# EAGLE schematic MotorController (EAGLE 9.6.1)
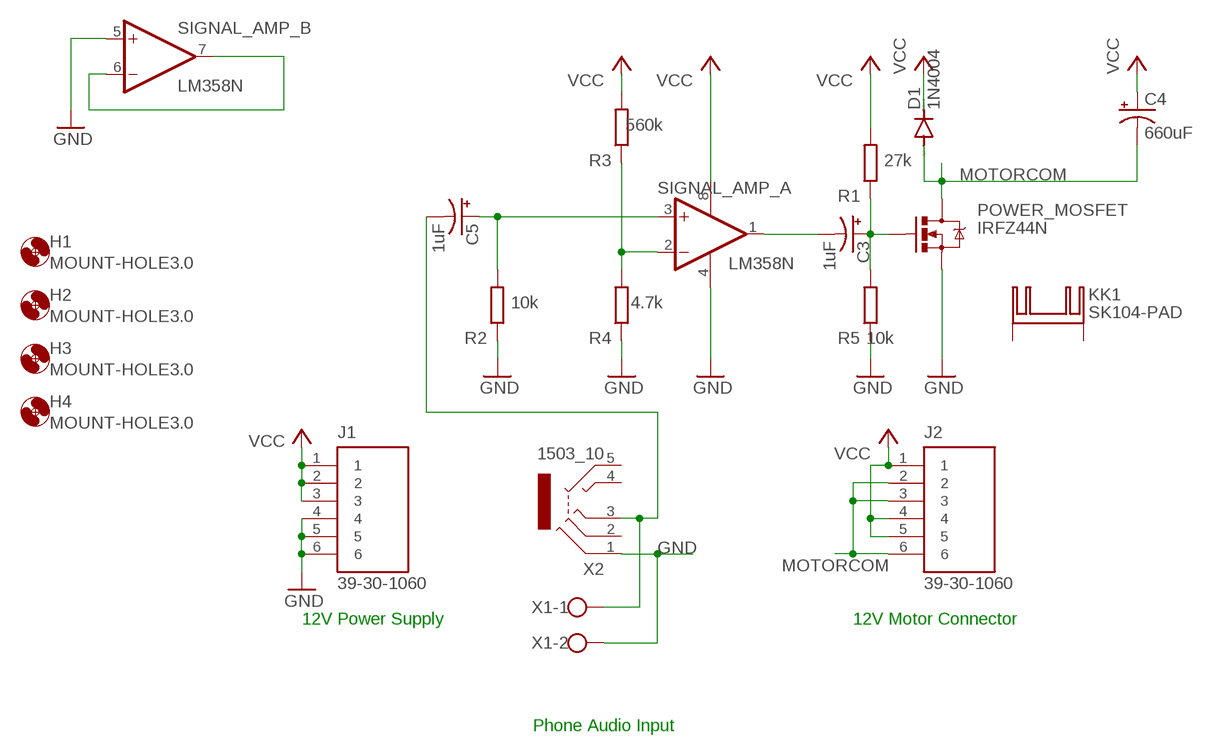
[diagram p0: schematic, sheet 1]

## Parts
C3  1uF  CPOL-USE2.5-7  [E2,5-7]
C4  660uF  CPOL-USE5-10.5  [E5-10,5]
C5  1uF  CPOL-USE2.5-7  [E2,5-7]
D1  1N4004  [DO41-10]
H1  MOUNT-HOLE3.0  [3,0]
H2  MOUNT-HOLE3.0  [3,0]
H3  MOUNT-HOLE3.0  [3,0]
H4  MOUNT-HOLE3.0  [3,0]
J1  39-30-1060  [MOLEX_39-30-1060]
J2  39-30-1060  [MOLEX_39-30-1060]
KK1  SK104-PAD  [SK104-PAD]
POWER_MOSFET  IRFZ44N  [TO-220]
R1  27k  R-EU_0204/7  [0204/7]
R2  10k  R-EU_0204/7  [0204/7]
R3  560k  R-EU_0204/7  [0204/7]
R4  4.7k  R-EU_0204/7  [0204/7]
R5  10k  R-EU_0204/7  [0204/7]
SIGNAL_AMP_  LM358N  [DIL08]
X1  W237-102  [W237-102]
X2  1503_10  [1503_10]

## Nets
GND [Power]: J1.4 J1.5 J1.6 POWER_MOSFET.3(S) R2.1 R4.1 R5.1 SIGNAL_AMP_.4(P:V-) SIGNAL_AMP_.5(B:+IN) X1.2 X2.1
MOTORCOM [Power]: C4.- D1.A J2.2 J2.3 J2.6 POWER_MOSFET.2(D)
N$1 [Signal]: C5.+ R2.2 SIGNAL_AMP_.3(A:+IN)
N$2 [Signal]: R3.1 R4.2 SIGNAL_AMP_.2(A:-IN)
N$3 [Signal]: C3.- SIGNAL_AMP_.1(A:OUT)
N$4 [Signal]: C3.+ POWER_MOSFET.1(G) R1.1 R5.2
N$5: SIGNAL_AMP_.6(B:-IN) SIGNAL_AMP_.7(B:OUT)
N$7 [Signal]: C5.- X1.1 X2.3
VCC [Power]: C4.+ D1.C J1.1 J1.2 J1.3 J2.1 J2.4 J2.5 R1.2 R3.2 SIGNAL_AMP_.8(P:V+)
Unconnected: KK1.K1(K) KK1.K2(K) X2.2 X2.4 X2.5

## Notes on the sheet
- 12V Power Supply | 12V Motor Connector
- Phone Audio Input

## Library data of the parts
C3-C5 = adafruit:CPOL-US: POLARIZED CAPACITOR, American symbol
D1 = diode:1N4004: DIODE general purpose rectifier, 1 A
H1-H4 = holes:MOUNT-HOLE: MOUNTING HOLE with drill center marker
J1 J2 = 39-30-1060:39-30-1060: Conn Power HDR 6 POS 4.2mm Solder RA Thru-Hole 6 Terminal 1 Port Mini-Fit; AVAILABILITY: Unavailable; DESCRIPTION: Connector Header Through Hole, Right Angle 6 position 0.165 _4.20mm_; MF: Molex; MP: 39-30-1060; PACKAGE: None; PRICE: None
KK1 = heatsink:SK104-PAD: HEATSINK manufacturer Fischer/distributor Buerklin
POWER_MOSFET = IRFZ44N:IRFZ44N; AVAILABILITY: Unavailable; DESCRIPTION: N-Channel 55V 49A _Tc_ 3.8W _Ta_, 94W _Tc_ Surface Mount D2PAK; MF: Infineon Technologies; MP: IRFZ44N; PACKAGE: D2PAK NXP Semiconductors; PRICE: None
R1-R5 = rcl:R-EU_: RESISTOR, European symbol; SPICEPREFIX: R
SIGNAL_AMP_ = linear:LM358: OP AMP also LM158; LM258; LM2904 Source: http://cache.national.com/ds/LM/LM158.pdf
X1 = con-wago-500:W237-102: WAGO SCREW CLAMP; MPN: 237-102; OC_FARNELL: unknown; OC_NEWARK: 70K9898
X2 = con-lumberg:1503_10: Jack connectors according to JISC 6560, 3.5 mm Klinkeneinbaukupplung, 3,5 mm, 4-polig/stereo, abgewinkelte Ausführung Source: http://www.lumberg.de/Produkte/PDFs/1503_10.pdf; OC_FARNELL: 1308868; OC_NEWARK: unknown

## Net classes
1 Power: width 1.27 mm
2 Signal: width 0.889 mm